# Altium schematic sheet MEM.SchDoc: Storage Sub-board
size Letter; CompanyName: Hello Inc.; DrawnBy: John Kelley; Organization: Hello Inc.; Revision: EVT2; SheetNumber: 7; SheetTotal: 8
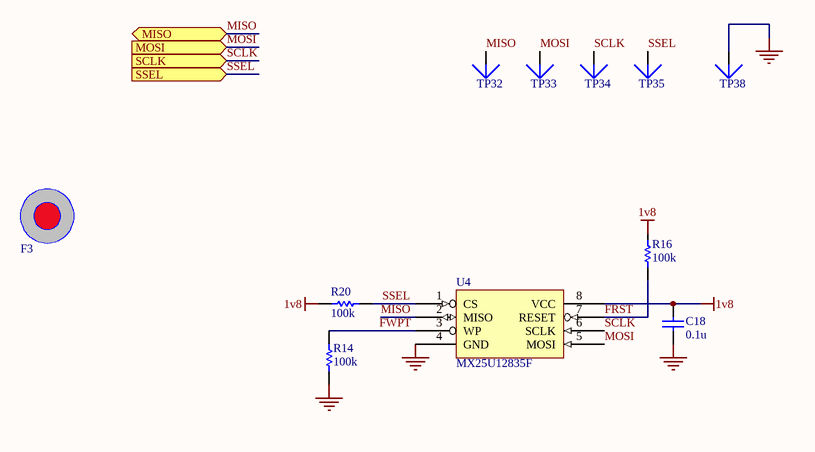
[diagram p0: MEM.SchDoc]

## Parts
C18  0.1u  [CAP0201]
F3  Fiducial  [Fiducial-0.5]  (value not drawn)  (no BOM)
R14  100k  [RES0201]
R16  100k  [RES0201]
R20  100k  [RES0201]
TP32  TestPoint  [TP-0.3]  (value not drawn)
TP33  TestPoint  [TP-0.3]  (value not drawn)
TP34  TestPoint  [TP-0.3]  (value not drawn)
TP35  TestPoint  [TP-0.3]  (value not drawn)
TP38  TestPoint  [TP-0.3]  (value not drawn)
U4  MX25U12835F  [WSON 8L]

## Ports
MISO, MOSI (in), SCLK (in), SSEL (in)

## Nets
1v8: C18.2 R20.1 U4.8(VCC)
GND: C18.1 R14.1 TP38.1 U4.4(GND)
FRST: R16.1 U4.7(RESET)
FWPT: R14.2 U4.3(WP)
MISO: TP32.1 U4.2(MISO) ; port MISO
MOSI: TP33.1 U4.5(MOSI) ; port MOSI
SCLK: TP34.1 U4.6(SCLK) ; port SCLK
SSEL: R20.2 TP35.1 U4.1(CS) ; port SSEL

Not connected (* = marked no-connect by the designer): R16 2

## Notes on the sheet
- Labels drawn without touching a wire or pin: 1v8
- TITLE
- DATE
- DRAWN BY
- REV
- SHEET
- OF

## Library data of the parts
C18 = C_0.1u_10_6.3_X5R_0201: Chip capacitor; Vendor: Taiyo Yuden; PN: JMK063BJ104KP-F; Tolerance: 10%; Voltage: 6.3; Temp: X5R; Value: 0.1u; Size: 0201
F3 = Fiducial-0.5: Fiducial with 0.5mm radius and 0.5mm paste expansion
R14 R16 R20 = R_100k_5_0.05_0201: Chip Resistor; Vendor: Panasonic; Tolerance: 5 %; Power: 0.05 W; PN: ERJ-1GEJ104C; Model: *; Value: 100k; Size: 0201
TP32-TP35 TP38 = TestPoint: Generic Test Point
U4 = MX25U12835F: Macronix MX25U12835F SPI NOR Flash